# Altium project GoKart PDU_V3.PrjPcb
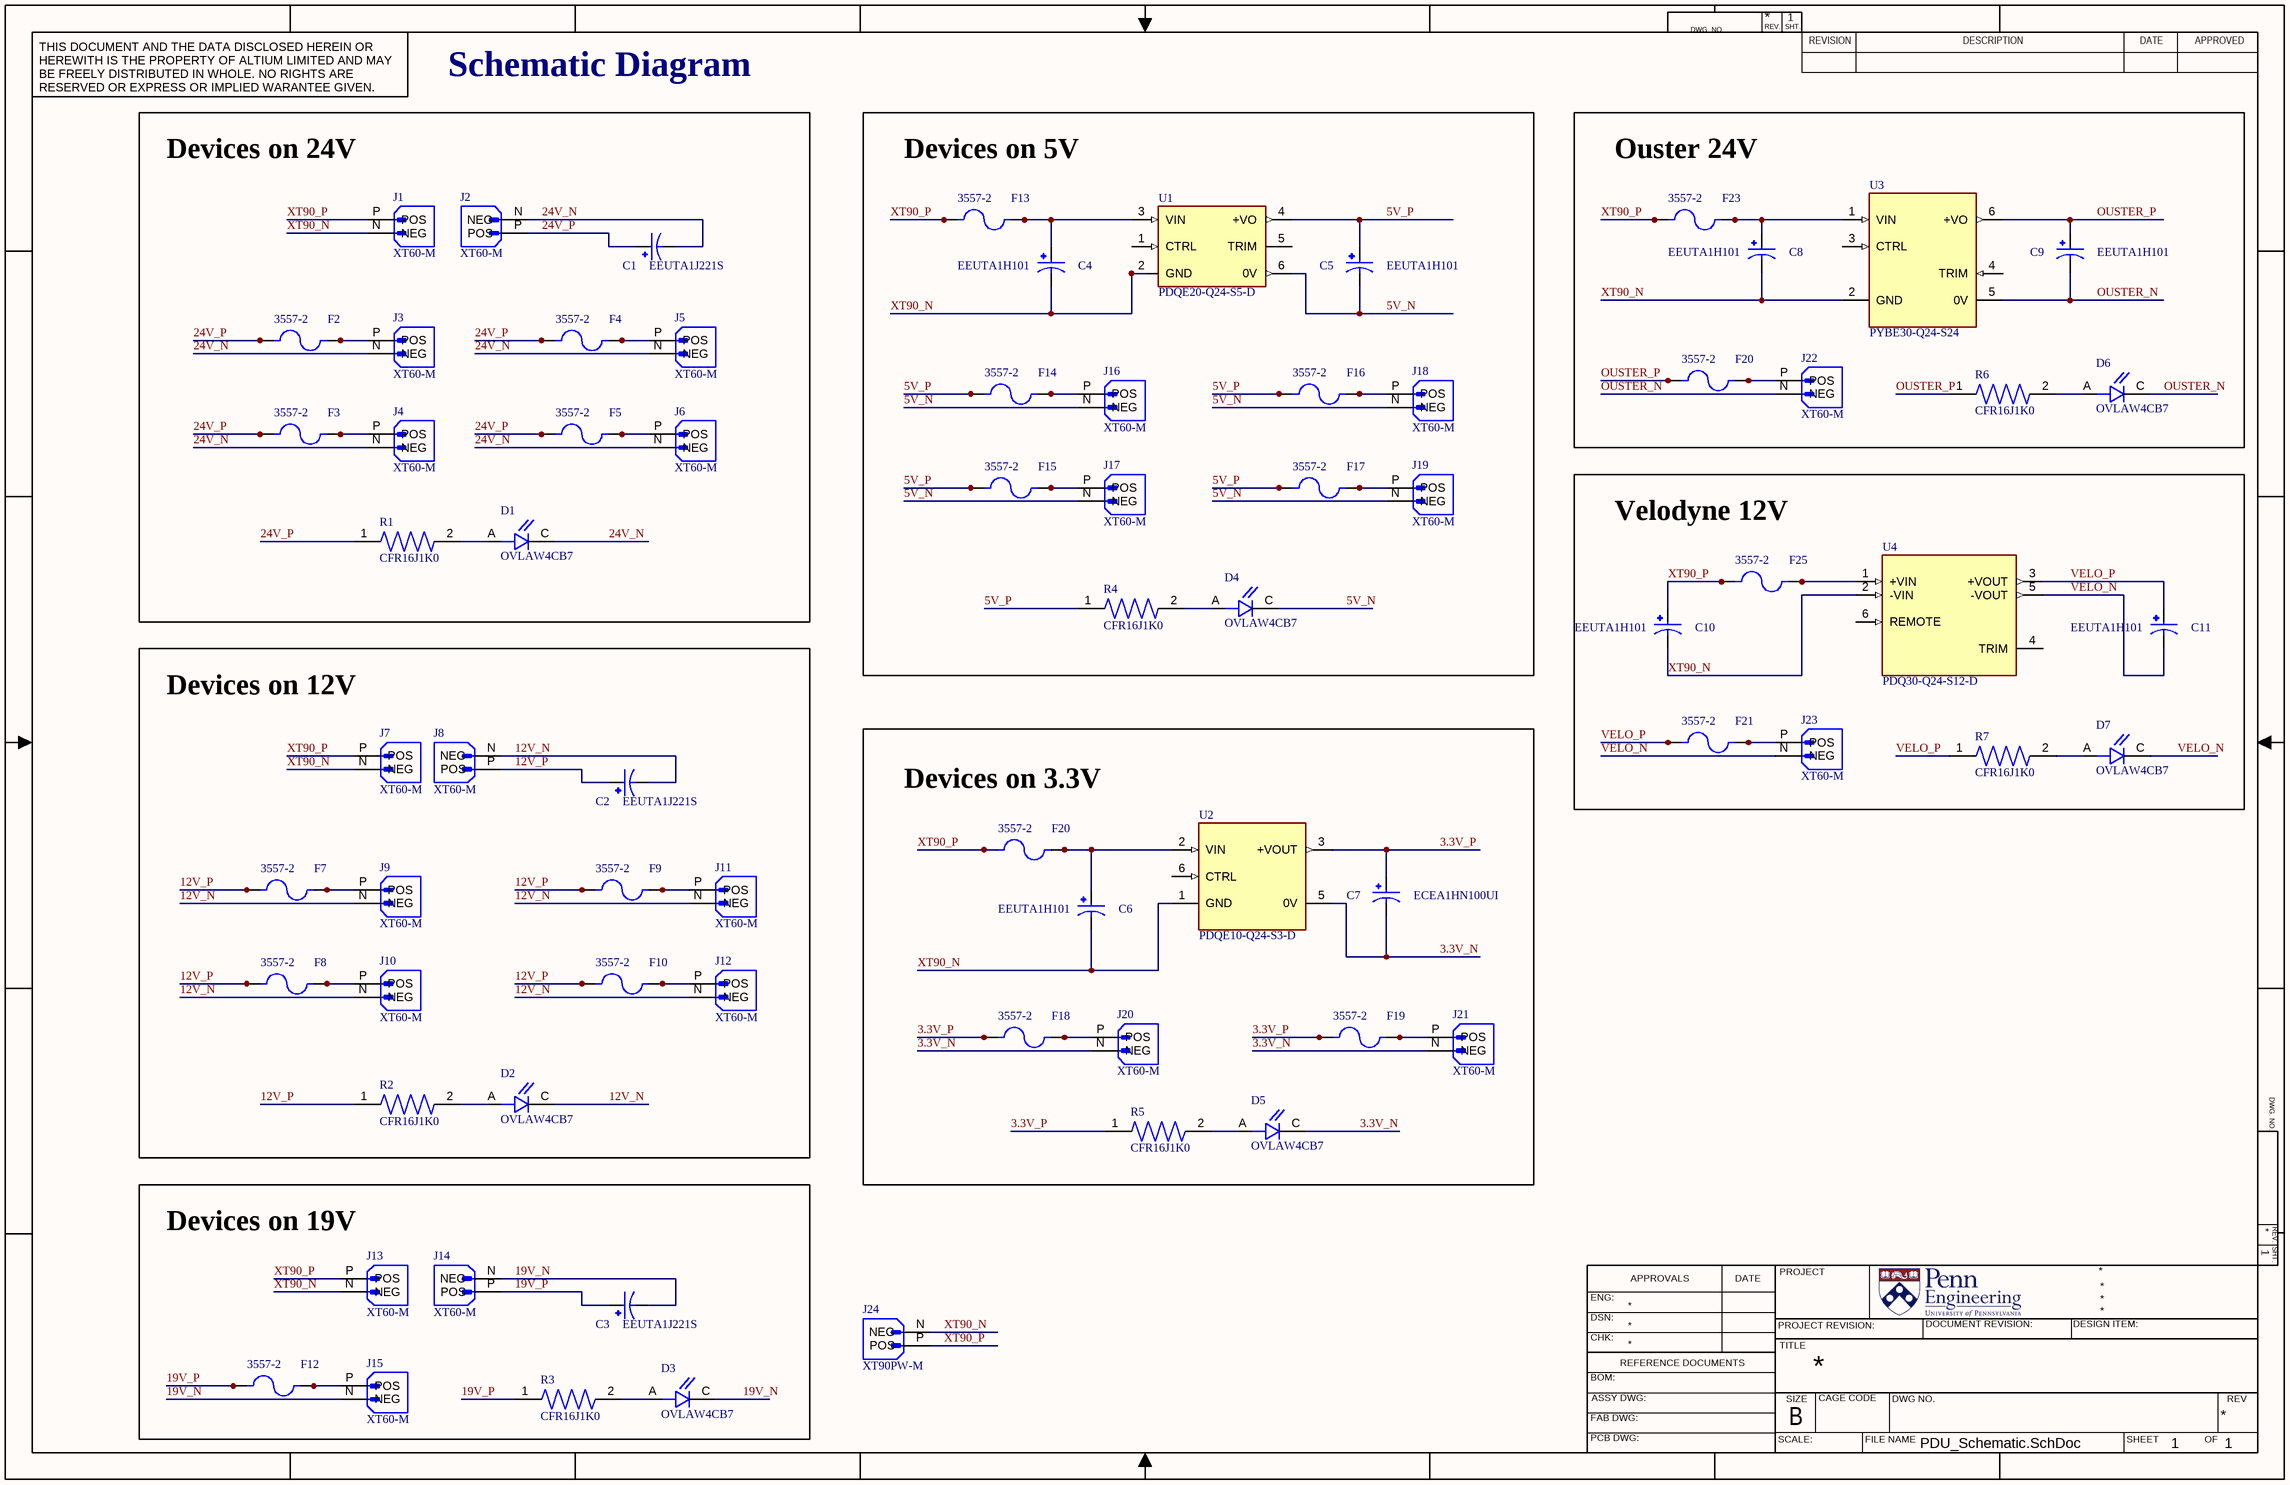
[diagram p0: PDU_Schematic.SchDoc]
1 sheet, 74 parts. Net scope: strictly hierarchical (ports join the sheet entries above them; power ports are local).
Board file: PDU_Main.PcbDoc

## Sheet PDU_Schematic.SchDoc
size 431 x 279 mm; SheetNumber: 1; SheetTotal: 1

### Parts
(Parts that share a designator on the sheet are numbered #1, #2 ... from top to bottom, then left to right.)
C1  EEUTA1J221S  [CAPPRD750W80D1800H1500]
C2  EEUTA1J221S  [CAPPRD750W80D1800H1500]
C3  EEUTA1J221S  [CAPPRD750W80D1800H1500]
C4  EEUTA1H101  [CAPPRD500W60D1000H1250]
C5  EEUTA1H101  [CAPPRD500W60D1000H1250]
C6  EEUTA1H101  [CAPPRD500W60D1000H1250]
C7  ECEA1HN100UI  [CAPPRD250W50D630H1120]
C8  EEUTA1H101  [CAPPRD500W60D1000H1250]
C9  EEUTA1H101  [CAPPRD500W60D1000H1250]
C10  EEUTA1H101  [CAPPRD500W60D1000H1250]
C11  EEUTA1H101  [CAPPRD500W60D1000H1250]
D1  OVLAW4CB7  [LEDRD254W50D305H520P]
D2  OVLAW4CB7  [LEDRD254W50D305H520P]
D3  OVLAW4CB7  [LEDRD254W50D305H520P]
D4  OVLAW4CB7  [LEDRD254W50D305H520P]
D5  OVLAW4CB7  [LEDRD254W50D305H520P]
D6  OVLAW4CB7  [LEDRD254W50D305H520P]
D7  OVLAW4CB7  [LEDRD254W50D305H520P]
F2  3557-2  [FUSE_3557-2]
F3  3557-2  [FUSE_3557-2]
F4  3557-2  [FUSE_3557-2]
F5  3557-2  [FUSE_3557-2]
F7  3557-2  [FUSE_3557-2]
F8  3557-2  [FUSE_3557-2]
F9  3557-2  [FUSE_3557-2]
F10  3557-2  [FUSE_3557-2]
F12  3557-2  [FUSE_3557-2]
F13  3557-2  [FUSE_3557-2]
F14  3557-2  [FUSE_3557-2]
F15  3557-2  [FUSE_3557-2]
F16  3557-2  [FUSE_3557-2]
F17  3557-2  [FUSE_3557-2]
F18  3557-2  [FUSE_3557-2]
F19  3557-2  [FUSE_3557-2]
F20#1  3557-2  [FUSE_3557-2]
F20#2  3557-2  [FUSE_3557-2]
F21  3557-2  [FUSE_3557-2]
F23  3557-2  [FUSE_3557-2]
F25  3557-2  [FUSE_3557-2]
J1  XT60-M  [AMASS_XT60-M]
J2  XT60-M  [AMASS_XT60-M]
J3  XT60-M  [AMASS_XT60-M]
J4  XT60-M  [AMASS_XT60-M]
J5  XT60-M  [AMASS_XT60-M]
J6  XT60-M  [AMASS_XT60-M]
J7  XT60-M  [AMASS_XT60-M]
J8  XT60-M  [AMASS_XT60-M]
J9  XT60-M  [AMASS_XT60-M]
J10  XT60-M  [AMASS_XT60-M]
J11  XT60-M  [AMASS_XT60-M]
J12  XT60-M  [AMASS_XT60-M]
J13  XT60-M  [AMASS_XT60-M]
J14  XT60-M  [AMASS_XT60-M]
J15  XT60-M  [AMASS_XT60-M]
J16  XT60-M  [AMASS_XT60-M]
J17  XT60-M  [AMASS_XT60-M]
J18  XT60-M  [AMASS_XT60-M]
J19  XT60-M  [AMASS_XT60-M]
J20  XT60-M  [AMASS_XT60-M]
J21  XT60-M  [AMASS_XT60-M]
J22  XT60-M  [AMASS_XT60-M]
J23  XT60-M  [AMASS_XT60-M]
J24  XT90PW-M  [AMASS_XT90PW-M]
R1  CFR16J1K0  [RESAD700W45L350D185]
R2  CFR16J1K0  [RESAD700W45L350D185]
R3  CFR16J1K0  [RESAD700W45L350D185]
R4  CFR16J1K0  [RESAD700W45L350D185]
R5  CFR16J1K0  [RESAD700W45L350D185]
R6  CFR16J1K0  [RESAD700W45L350D185]
R7  CFR16J1K0  [RESAD700W45L350D185]
U1  PDQE20-Q24-S5-D  [CONV_PDQE20-Q24-S5-D]
U2  PDQE10-Q24-S3-D  [CONV_PDQE10-Q24-S3-D]
U3  PYBE30-Q24-S24  [CONV_PYBE30-Q24-S24]
U4  PDQ30-Q24-S12-D  [CONV_PDQ30-Q24-S12-D]

### Blocks framed on the sheet
Devices on 24V: C1 D1 F2-F5 J1-J6 R1
Devices on 5V: C4 C5 D4 F13-F17 J16-J19 R4 U1
Ouster 24V: C8 C9 D6 F20#1 F23 J22 R6 U3
Velodyne 12V: C10 C11 D7 F21 F25 J23 R7 U4
Devices on 12V: C2 D2 F7-F10 J7-J12 R2
Devices on 3.3V: C6 C7 D5 F18 F19 F20#2 J20 J21 R5 U2
Devices on 19V: C3 D3 F12 J13-J15 R3

### Nets
3.3V_N: C7.N D5.C J20.N(NEG) J21.N(NEG) U2.5(0V)
3.3V_P: C7.P F18.1_1 F18.1_2 F19.1_1 F19.1_2 R5.1 U2.3(+VOUT)
5V_N: C5.N D4.C J16.N(NEG) J17.N(NEG) J18.N(NEG) J19.N(NEG) U1.6(0V)
5V_P: C5.P F14.1_1 F14.1_2 F15.1_1 F15.1_2 F16.1_1 F16.1_2 F17.1_1 F17.1_2 R4.1 U1.4(+VO)
12V_N: C2.N D2.C J8.N(NEG) J9.N(NEG) J10.N(NEG) J11.N(NEG) J12.N(NEG)
12V_P: C2.P F7.1_1 F7.1_2 F8.1_1 F8.1_2 F9.1_1 F9.1_2 F10.1_1 F10.1_2 J8.P(POS) R2.1
19V_N: C3.N D3.C J14.N(NEG) J15.N(NEG)
19V_P: C3.P F12.1_1 F12.1_2 J14.P(POS) R3.1
24V_N: C1.N D1.C J2.N(NEG) J3.N(NEG) J4.N(NEG) J5.N(NEG) J6.N(NEG)
24V_P: C1.P F2.1_1 F2.1_2 F3.1_1 F3.1_2 F4.1_1 F4.1_2 F5.1_1 F5.1_2 J2.P(POS) R1.1
OUSTER_N: C9.N D6.C J22.N(NEG) U3.5(0V)
OUSTER_P: C9.P F20#1.1_1 F20#1.1_2 R6.1 U3.6(+VO)
VELO_N: C11.N D7.C J23.N(NEG) U4.5(-VOUT)
VELO_P: C11.P F21.1_1 F21.1_2 R7.1 U4.3(+VOUT)
XT90_N: C4.N C6.N C8.N C10.N J1.N(NEG) J7.N(NEG) J13.N(NEG) J24.N(NEG) U1.2(GND) U2.1(GND) U3.2(GND) U4.2(-VIN)
XT90_P: C10.P F13.1_1 F13.1_2 F20#2.1_1 F20#2.1_2 F23.1_1 F23.1_2 F25.1_1 F25.1_2 J1.P(POS) J7.P(POS) J13.P(POS) J24.P(POS)
NetC4_P: C4.P F13.2_1 F13.2_2 U1.3(VIN)
NetC6_P: C6.P F20#2.2_1 F20#2.2_2 U2.2(VIN)
NetC8_P: C8.P F23.2_1 F23.2_2 U3.1(VIN)
NetD1_A: D1.A R1.2
NetD2_A: D2.A R2.2
NetD3_A: D3.A R3.2
NetD4_A: D4.A R4.2
NetD5_A: D5.A R5.2
NetD6_A: D6.A R6.2
NetD7_A: D7.A R7.2
NetF2_2_1: F2.2_1 F2.2_2 J3.P(POS)
NetF3_2_1: F3.2_1 F3.2_2 J4.P(POS)
NetF4_2_1: F4.2_1 F4.2_2 J5.P(POS)
NetF5_2_1: F5.2_1 F5.2_2 J6.P(POS)
NetF7_2_1: F7.2_1 F7.2_2 J9.P(POS)
NetF8_2_1: F8.2_1 F8.2_2 J10.P(POS)
NetF9_2_1: F9.2_1 F9.2_2 J11.P(POS)
NetF10_2_1: F10.2_1 F10.2_2 J12.P(POS)
NetF12_2_1: F12.2_1 F12.2_2 J15.P(POS)
NetF14_2_1: F14.2_1 F14.2_2 J16.P(POS)
NetF15_2_1: F15.2_1 F15.2_2 J17.P(POS)
NetF16_2_1: F16.2_1 F16.2_2 J18.P(POS)
NetF17_2_1: F17.2_1 F17.2_2 J19.P(POS)
NetF18_2_1: F18.2_1 F18.2_2 J20.P(POS)
NetF19_2_1: F19.2_1 F19.2_2 J21.P(POS)
NetF20#1_2_1: F20#1.2_1 F20#1.2_2 J22.P(POS)
NetF21_2_1: F21.2_1 F21.2_2 J23.P(POS)
NetF25_2_1: F25.2_1 F25.2_2 U4.1(+VIN)

Not connected (* = marked no-connect by the designer): U1 1(CTRL) 5(TRIM); U2 6(CTRL); U3 3(CTRL) 4(TRIM); U4 4(TRIM) 6(REMOTE)

### Notes on the sheet
- Schematic Diagram
- DWG. NO.
- REV.
- SHT.
- THIS DOCUMENT AND THE DATA DISCLOSED HEREIN OR HEREWITH IS THE PROPERTY OF ALTIUM LIMITED AND MAY BE FREELY DISTRIBUTED IN WHOLE. NO RIGHTS ARE RESERVED OR EXPRESS OR IMPLIED WARANTEE GIVEN.
- REVISION
- DESCRIPTION
- DATE
- APPROVED
- ENG:
- APPROVALS
- PROJECT
- DSN:
- CHK:
- REFERENCE DOCUMENTS
- PROJECT REVISION:
- TITLE
- DOCUMENT REVISION:
- DESIGN ITEM:
- BOM:
- FAB DWG:
- PCB DWG:
- ASSY DWG:
- SCALE:
- SIZE
- B
- CAGE CODE
- FILE NAME
- DWG NO.
- SHEET
- OF
- REV

### Library data of the parts
C1-C3 = EEUTA1J221S: CAP ALUM 220UF 20% 63V RADIAL; MP: EEU-TA1J221S; MF: Panasonic; Purchase-URL: https://pricing.snapeda.com/search/part/EEU-TA1J221S/?ref=eda; Package: RADIAL-2 Panasonic; Value: *; SnapEDA_Link: https://www.snapeda.com/parts/EEU-TA1J221S/Panasonic/view-part/2346469/?ref=snap; Availability: In Stock; Price: None; Check_prices: https://www.snapeda.com/parts/EEU-TA1J221S/Panasonic/view-part/2346469/?ref=eda
C4-C6 C8-C11 = EEUTA1H101: Cap Aluminum Lytic 100uF 50V 20% (10 X 12.5mm) Radial 5mm 555mA 2000h 125Â°C Automotive Bulk; MF: Panasonic; MP: EEUTA1H101; Package: RADIAL-2 Panasonic; SnapEDA_Link: https://www.snapeda.com/parts/EEUTA1H101/Panasonic/view-part/2305858/?ref=snap; Check_prices: https://www.snapeda.com/parts/EEUTA1H101/Panasonic/view-part/2305858/?ref=eda; Value: *; Digi-Key_Part_Number: 10-EEU-TA1H101BCT-ND
C7 = ECEA1HN100UI: CAP ALUM 10UF 20% 50V RADIAL; MP: ECE-A1HN100UI; MF: Panasonic; SnapEDA_Link: https://www.snapeda.com/parts/ECE-A1HN100UI/Panasonic/view-part/2321690/?ref=snap; Price: None; Check_prices: https://www.snapeda.com/parts/ECE-A1HN100UI/Panasonic/view-part/2321690/?ref=eda; Value: *; Availability: In Stock; Package: RADIAL-2 Panasonic
D1-D7 = OVLAW4CB7: White LED Indication - Discrete 3.2V Radial; MF: TT Electronics/Optek; Value: *; SnapEDA_Link: https://www.snapeda.com/parts/OVLAW4CB7/TT%20Electronics/Optek%20Technology/view-part/328075/?ref=snap; Availability: Unavailable; Package: Radial Optek; Price: None; MP: OVLAW4CB7
J1-J23 = XT60-M: Plug; DC supply; XT60; male; PIN: 2; for cable; soldered; 30A; 500V; MF: AMASS; Price: None; Availability: Not in stock; Package: Package; MP: XT60-M; Value: *; SnapEDA_Link: https://www.snapeda.com/parts/XT60-M/AMASS/view-part/?ref=snap; Check_prices: https://www.snapeda.com/parts/XT60-M/AMASS/view-part/?ref=eda
J24 = XT90PW-M: Socket; DC supply; XT90; male; PIN: 2; on PCBs; THT; Colour: yellow; MF: AMASS; MP: XT90PW-M; Package: Package; Availability: Not in stock; Value: *; Price: None; Check_prices: https://www.snapeda.com/parts/XT90PW-M/AMASS/view-part/?ref=eda; SnapEDA_Link: https://www.snapeda.com/parts/XT90PW-M/AMASS/view-part/?ref=snap
R1-R7 = CFR16J1K0: 1 kOhms Â±5% 0.25W, 1/4W Through Hole Resistor Axial - Carbon Film; MF: TE Connectivity Passive Product; Purchase-URL: https://pricing.snapeda.com/search/part/CFR16J1K0/?ref=eda; MP: CFR16J1K0; Package: Axial TE Connectivity Passive Product; SnapEDA_Link: https://www.snapeda.com/parts/CFR16J1K0/TE+Connectivity/view-part/?ref=snap; Price: None; Availability: In Stock; Value: *; Check_prices: https://www.snapeda.com/parts/CFR16J1K0/TE+Connectivity/view-part/?ref=eda
U1 = PDQE20-Q24-S5-D: 20 W, 4:1 Input Range, Single/Dual Regulated Output, DIP, 1500 Vdc Isolation, DC-Dc Converter; MF: {'manufacturer': u'CUI'}; MP: PDQE20-Q24-S5-D; Package: None; Price: None; Availability: Unavailable; Value: *
U2 = PDQE10-Q24-S3-D: MF: {'manufacturer': u'CUI'}; Price: None; Value: *; MP: PDQE10-Q24-S3-D; Availability: Unavailable; Package: None
U3 = PYBE30-Q24-S24: 30 W, 4:1 Input Range, Single/Dual Regulated Output,  DIP, 1500 Vdc Isolation, Dc-Dc Converter; MF: CUI Inc.; SnapEDA_Link: https://www.snapeda.com/parts/PYBE30-Q24-S24/CUI/view-part/3228820/?ref=snap; Digi-Key_Purchase_URL: https://www.digikey.com/product-detail/en/cui-inc/PYBE30-Q24-S24/102-6020-ND/9859976?utm_source=snapeda&utm_medium=aggregator&utm_campaign=symbol; CUI_purchase_URL: https://www.cui.com/product/dc-dc-converters/isolated/pybe30-series?utm_source=snapeda.com&utm_medium=referral&utm_campaign=snapedaBOM; MP: PYBE30-Q24-S24; Digi-Key_Part_Number: 102-6020-ND; Value: *; Package: DIP-6 CUI Inc.
U4 = PDQ30-Q24-S12-D: 30 W, 4:1 Input Range, Single/Dual Regulated Output, 1500 Vdc Isolation, Dc-Dc Converter; MF: CUI Inc.; Package: DIP-6; Value: *; SnapEDA_Link: https://www.snapeda.com/parts/PDQ30-Q24-S12-D/CUI/view-part/573769/?ref=snap; Availability: Unavailable; MP: PDQ30-Q24-S12-D; Price: None
F2-F5 F7-F10 F12-F19 F20#1 F20#2 F21 F23 F25 = 3557-2: Package: None; MP: 3557-2; Value: *; Availability: Unavailable; Price: None